# Altium schematic sheet mainboard.SchDoc
size C; SheetNumber: 1; SheetTotal: 1
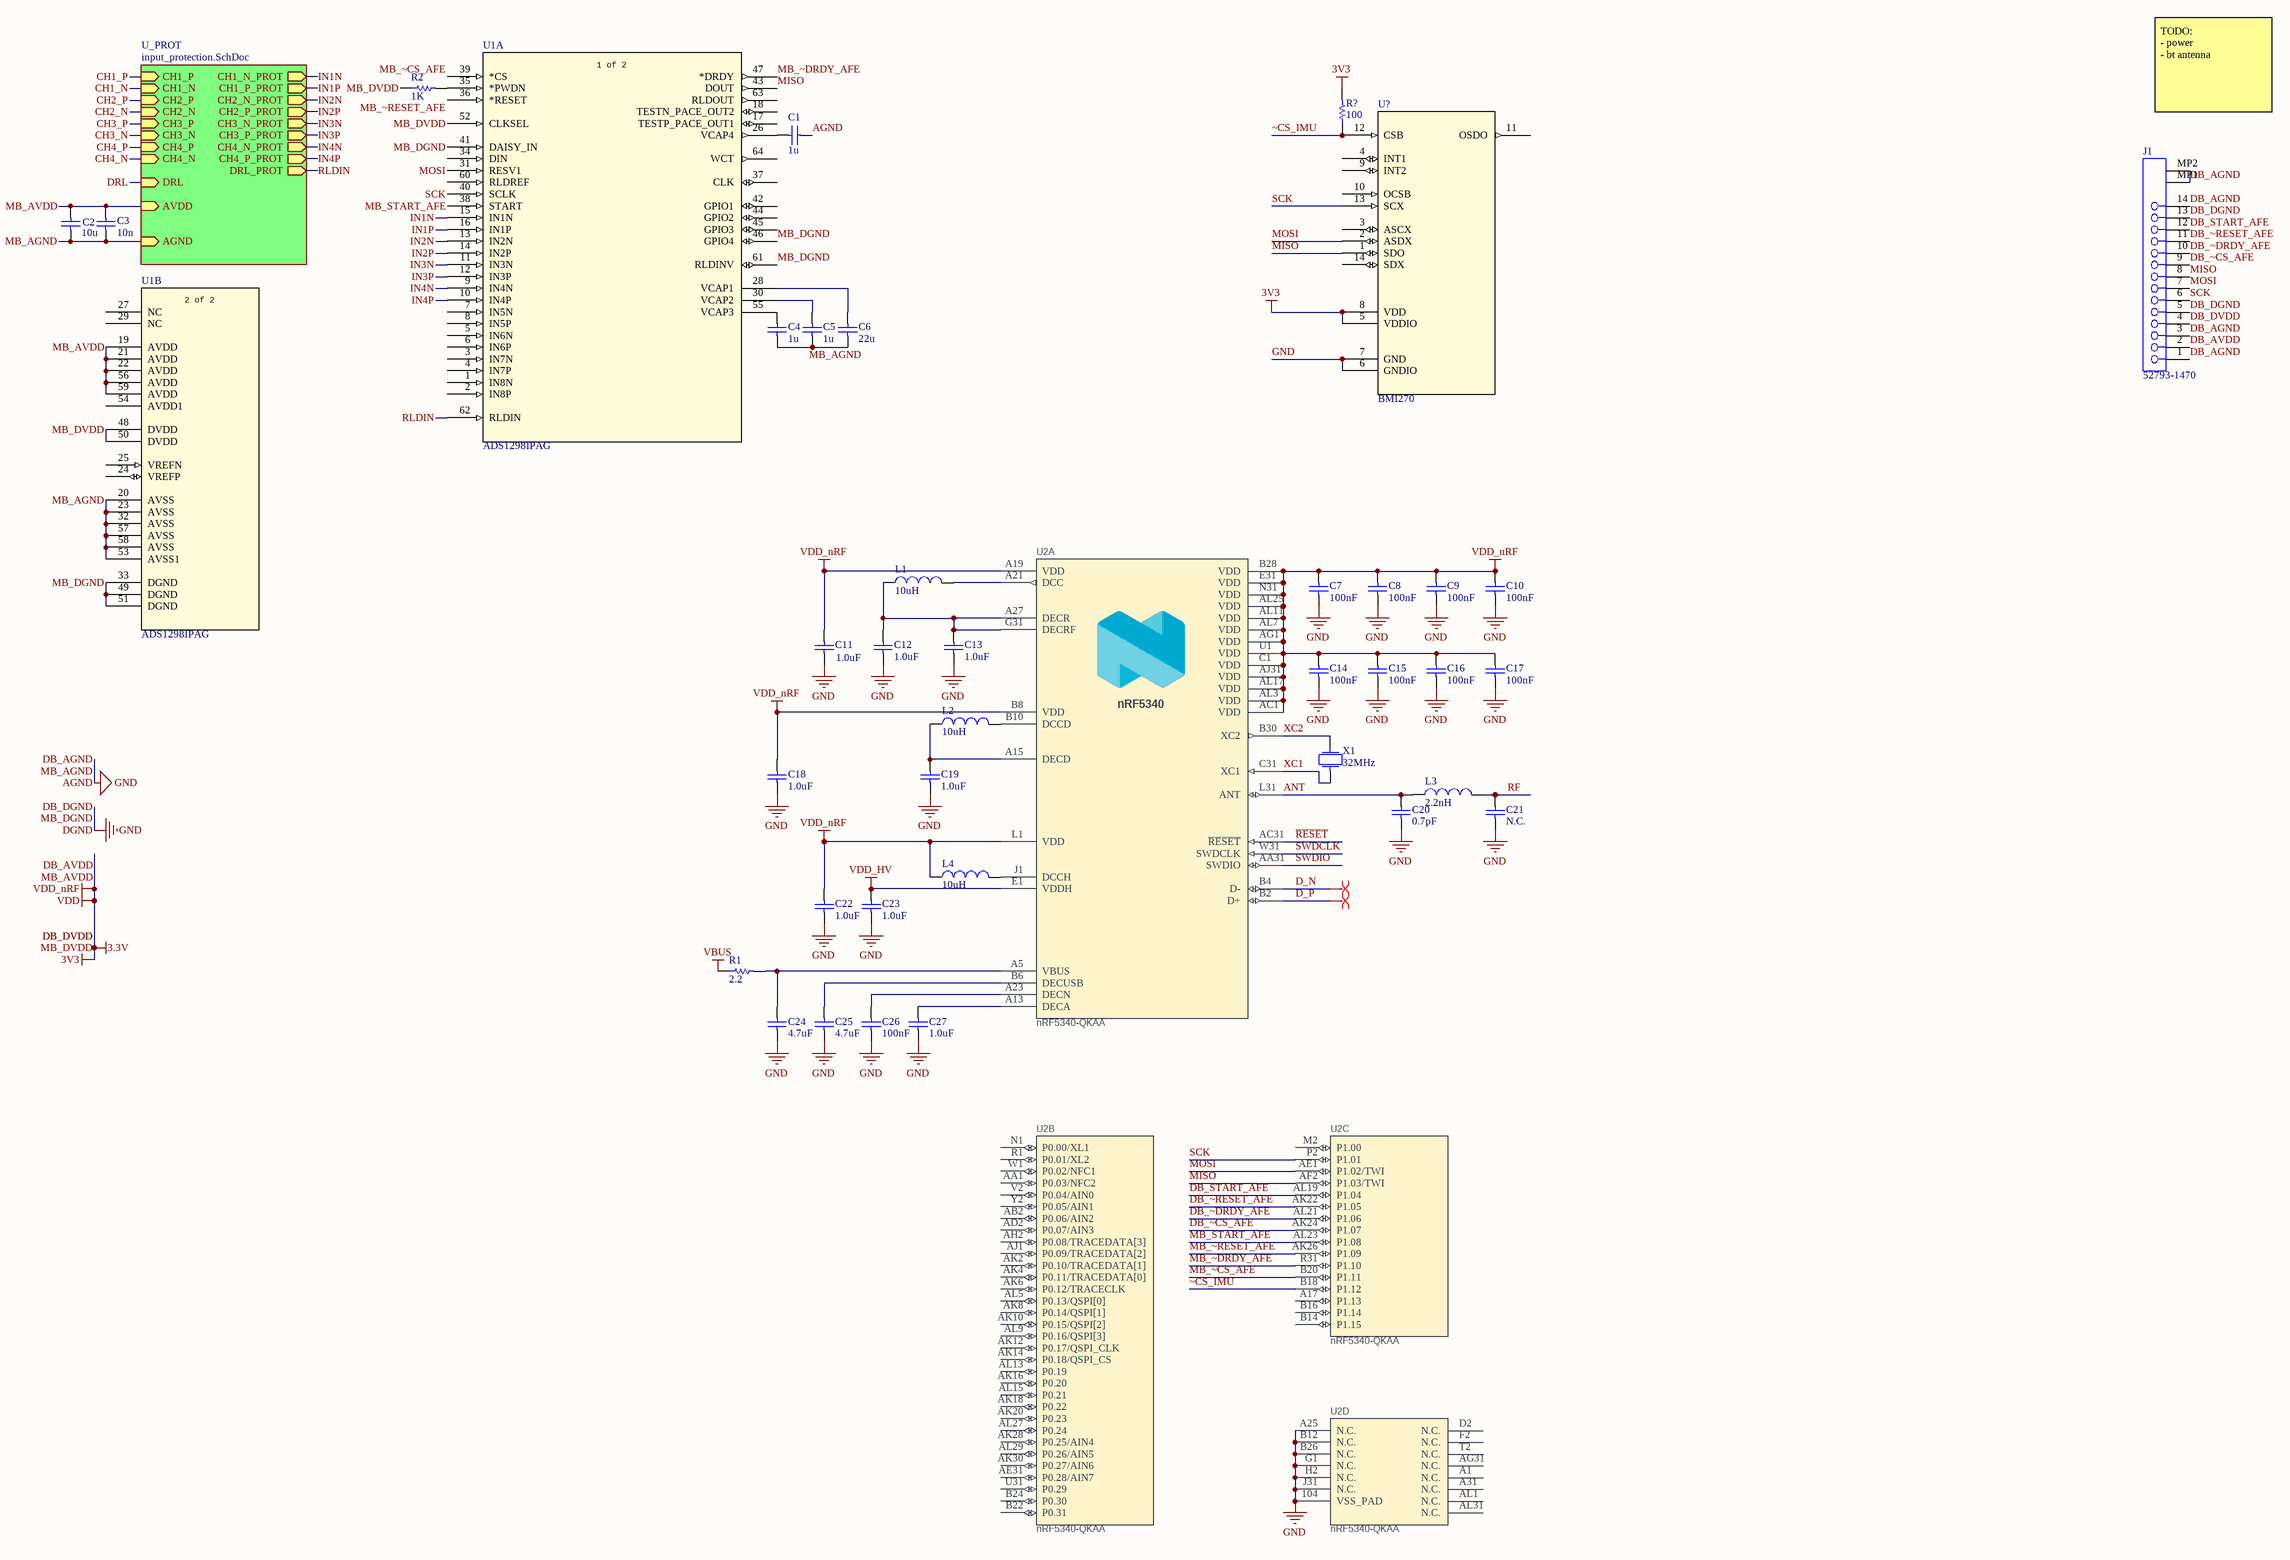
[diagram p0: mainboard.SchDoc]

## Parts
C1  value 1u  (hidden comment: Capacitor)
C2  value 10u  (hidden comment: Capacitor)
C3  value 10n  (hidden comment: Capacitor)
C4  value 1u  (hidden comment: Capacitor)
C5  value 1u  (hidden comment: Capacitor)
C6  value 22u  (hidden comment: Capacitor)
C7  value 100nF  (hidden comment: Capacitor)
C8  value 100nF  (hidden comment: Capacitor)
C9  value 100nF  (hidden comment: Capacitor)
C10  value 100nF  (hidden comment: Capacitor)
C11  value 1.0uF  (hidden comment: Capacitor)
C12  value 1.0uF  (hidden comment: Capacitor)
C13  value 1.0uF  (hidden comment: Capacitor)
C14  value 100nF  (hidden comment: Capacitor)
C15  value 100nF  (hidden comment: Capacitor)
C16  value 100nF  (hidden comment: Capacitor)
C17  value 100nF  (hidden comment: Capacitor)
C18  value 1.0uF  (hidden comment: Capacitor)
C19  value 1.0uF  (hidden comment: Capacitor)
C20  value 0.7pF  (hidden comment: Capacitor)
C21  value N.C.  (hidden comment: Capacitor)
C22  value 1.0uF  (hidden comment: Capacitor)
C23  value 1.0uF  (hidden comment: Capacitor)
C24  value 4.7uF  (hidden comment: Capacitor)
C25  value 4.7uF  (hidden comment: Capacitor)
C26  value 100nF  (hidden comment: Capacitor)
C27  value 1.0uF  (hidden comment: Capacitor)
J1  52793-1470  [MOLX-52793-1470]
L1  value 10uH  (hidden comment: Inductor)
L2  value 10uH  (hidden comment: Inductor)
L3  value 2.2nH  (hidden comment: Inductor)
L4  value 10uH  (hidden comment: Inductor)
R1  value 2.2  (hidden comment: Resistor)
R2  value 1K  (hidden comment: Resistor)
R?  value 100  (hidden comment: Resistor)
U1  ADS1298IPAG  [PAG64]  (parts A,B of 2)
U2  nRF5340-QKAA  [AQFN40P700X700X85_HS-99N]  (parts A,B,C,D of 4)
U?  BMI270  [BMI270_BOS]
X1  F0: 32MHz  (hidden comment: Crystal)

## Sub-sheets
U_PROT = input_protection.SchDoc: CH1_P (in), CH1_N_PROT (out), CH1_P_PROT (out), CH1_N (in), CH2_P (in), CH2_N (in), CH3_P (in), CH3_N (in), CH4_P (in), CH4_N (in), DRL (in), AVDD (in), AGND (in), CH2_N_PROT (out), CH2_P_PROT (out), CH3_N_PROT (out), CH3_P_PROT (out), CH4_N_PROT (out), CH4_P_PROT (out), DRL_PROT (out)

## Nets
AGND: C1.2 C2.2 C3.2 C4.2 C5.2 C6.2 C7.1 C8.1 C9.1 C10.1 C11.1 C12.1 C13.1 C14.1 C15.1 C16.1 C17.1 C18.1 C19.1 C20.1 C21.1 C22.1 C23.1 C24.1 C25.1 C26.1 C27.1 J1.1 J1.3 J1.5 J1.13 J1.14 J1.MP1 J1.MP2 U1.20(AVSS) U1.23(AVSS) U1.32(AVSS) U1.33(DGND) U1.41(DAISY_IN) U1.46(GPIO4) U1.49(DGND) U1.51(DGND) U1.53(AVSS1) U1.57(AVSS) U1.58(AVSS) U1.61(RLDINV) U2.104(VSS_PAD) U2.A25(N.C.) U2.B12(N.C.) U2.B26(N.C.) U2.G1(N.C.) U2.H2(N.C.) U2.J31(N.C.) U?.6(GNDIO) U?.7(GND) ; sheet U_PROT/AGND  [also labelled DB_AGND, DB_DGND, DGND, GND, MB_AGND, MB_DGND]
DB_AVDD: C2.1 C3.1 C7.2 C8.2 C9.2 C10.2 C11.2 C14.2 C15.2 C16.2 C17.2 C18.2 C22.2 J1.2 J1.4 L4.1 R2.1 R?.2 U1.19(AVDD) U1.21(AVDD) U1.22(AVDD) U1.48(DVDD) U1.50(DVDD) U1.52(CLKSEL) U1.56(AVDD) U1.59(AVDD) U2.A19(VDD) U2.AC1(VDD) U2.AG1(VDD) U2.AJ31(VDD) U2.AL3(VDD) U2.AL7(VDD) U2.AL11(VDD) U2.AL17(VDD) U2.AL25(VDD) U2.B8(VDD) U2.B28(VDD) U2.C1(VDD) U2.E31(VDD) U2.L1(VDD) U2.N31(VDD) U2.U1(VDD) U?.5(VDDIO) U?.8(VDD) ; sheet U_PROT/AVDD  [also labelled 3.3V, 3V3, DB_DVDD, MB_AVDD, MB_DVDD, VDD, VDD_nRF]
VBUS: R1.1
VDD_HV: C23.2 U2.E1(VDDH)
ANT: C20.2 L3.1 U2.L31(ANT)
CH1_N: sheet U_PROT/CH1_N
CH1_P: sheet U_PROT/CH1_P
CH2_N: sheet U_PROT/CH2_N
CH2_P: sheet U_PROT/CH2_P
CH3_N: sheet U_PROT/CH3_N
CH3_P: sheet U_PROT/CH3_P
CH4_N: sheet U_PROT/CH4_N
CH4_P: sheet U_PROT/CH4_P
D_N: U2.B4(D-)
D_P: U2.B2(D+)
DB_START_AFE: J1.12 U2.AL19(P1.04)
DB_~CS_AFE: J1.9 U2.AK24(P1.07)
DB_~DRDY_AFE: J1.10 U2.AL21(P1.06)
DB_~RESET_AFE: J1.11 U2.AK22(P1.05)
DRL: sheet U_PROT/DRL
IN1N: U1.15(IN1N) ; sheet U_PROT/CH1_N_PROT
IN1P: U1.16(IN1P) ; sheet U_PROT/CH1_P_PROT
IN2N: U1.13(IN2N) ; sheet U_PROT/CH2_N_PROT
IN2P: U1.14(IN2P) ; sheet U_PROT/CH2_P_PROT
IN3N: U1.11(IN3N) ; sheet U_PROT/CH3_N_PROT
IN3P: U1.12(IN3P) ; sheet U_PROT/CH3_P_PROT
IN4N: U1.9(IN4N) ; sheet U_PROT/CH4_N_PROT
IN4P: U1.10(IN4P) ; sheet U_PROT/CH4_P_PROT
MB_START_AFE: U1.38(START) U2.AL23(P1.08)
MB_~CS_AFE: U1.39(*CS) U2.B20(P1.11)
MB_~DRDY_AFE: U1.47(*DRDY) U2.R31(P1.10)
MB_~RESET_AFE: U1.36(*RESET) U2.AK26(P1.09)
MISO: J1.8 U1.43(DOUT) U2.AF2(P1.03/TWI) U?.1(SDO)
MOSI: J1.7 U1.31(RESV1) U2.AE1(P1.02/TWI) U?.2(ASDX)
~{RESET}: U2.AC31(~{RESET})
RF: C21.2 L3.2
RLDIN: U1.62(RLDIN) ; sheet U_PROT/DRL_PROT
SCK: J1.6 U1.40(SCLK) U2.P2(P1.01) U?.13(SCX)
SWDCLK: U2.W31(SWDCLK)
SWDIO: U2.AA31(SWDIO)
XC1: U2.C31(XC1) X1.1
XC2: U2.B30(XC2) X1.2
~CS_IMU: R?.1 U2.B18(P1.12) U?.12(CSB)
NetC1_1: C1.1 U1.26(VCAP4)
NetC4_1: C4.1 U1.55(VCAP3)
NetC5_1: C5.1 U1.30(VCAP2)
NetC6_1: C6.1 U1.28(VCAP1)
NetC12_2: C12.2 C13.2 L1.1 U2.A27(DECR) U2.G31(DECRF)
NetC19_2: C19.2 L2.1 U2.A15(DECD)
NetC24_2: C24.2 R1.2 U2.A5(VBUS)
NetC25_2: C25.2 U2.B6(DECUSB)
NetC26_2: C26.2 U2.A23(DECN)
NetC27_2: C27.2 U2.A13(DECA)
NetL1_2: L1.2 U2.A21(DCC)
NetL2_2: L2.2 U2.B10(DCCD)
NetL4_2: L4.2 U2.J1(DCCH)
NetR2_2: R2.2 U1.35(*PWDN)

Not connected (* = marked no-connect by the designer): U1 1(IN8N) 2(IN8P) 3(IN7N) 4(IN7P) 5(IN6N) 6(IN6P) 7(IN5N) 8(IN5P) 17(TESTP_PACE_OUT1) 18(TESTN_PACE_OUT2) 24(VREFP) 25(VREFN) 27(NC) 29(NC) 34(DIN) 37(CLK) 42(GPIO1) 44(GPIO2) 45(GPIO3) 54(AVDD1) 60(RLDREF) 63(RLDOUT) 64(WCT); U2 A1(N.C.) A17(P1.13) A31(N.C.) AA1(P0.03/NFC2) AB2(P0.06/AIN2) AD2(P0.07/AIN3) AE31(P0.28/AIN7) AG31(N.C.) AH2(P0.08/TRACEDATA[3]) AJ1(P0.09/TRACEDATA[2]) AK2(P0.10/TRACEDATA[1]) AK4(P0.11/TRACEDATA[0]) AK6(P0.12/TRACECLK) AK8(P0.14/QSPI[1]) AK10(P0.15/QSPI[2]) AK12(P0.17/QSPI_CLK) AK14(P0.18/QSPI_CS) AK16(P0.20) AK18(P0.22) AK20(P0.23) AK28(P0.25/AIN4) AK30(P0.27/AIN6) AL1(N.C.) AL5(P0.13/QSPI[0]) AL9(P0.16/QSPI[3]) AL13(P0.19) AL15(P0.21) AL27(P0.24) AL29(P0.26/AIN5) AL31(N.C.) B14(P1.15) B16(P1.14) B22(P0.31) B24(P0.30) D2(N.C.) F2(N.C.) M2(P1.00) N1(P0.00/XL1) R1(P0.01/XL2) T2(N.C.) U31(P0.29) V2(P0.04/AIN0) W1(P0.02/NFC1) Y2(P0.05/AIN1); U? 3(ASCX) 4(INT1) 9(INT2) 10(OCSB) 11(OSDO) 14(SDX)

## Layout directives
differential pair: D_N, D_P

## Notes on the sheet
- TODO:
  - power
  - bt antenna
- (in symbol ADS1298IPAG, part A) 1 of 2
- (in symbol ADS1298IPAG, part B) 2 of 2
- (in symbol nRF5340-QKAA, part A) nRF5340

## Library data of the parts
C1-C27 = Capacitor: SimulationGenericComponent: True
J1 = CMP-1241-00393-1: 1.0 mm Pitch Easy-On(TM) Type FFC Connector, 3.1 mm Mated Height, Right Angle, Non-ZIF, SMT, Top Contact, 14 Circuits, -20 to 85 degC, ELV and RoHS Compliant, Tape and Reel; Manufacturer: Molex; Pitch - Mating Interface: 1.00mm; PCB Retention: Yes; Polarized to PCB: No; Mated Height: 3.10mm; Voltage (Max): 50V; Material - Metal: Phosphor Bronze; Entry Angle: 90degrees Angle; Current (Max per Contact): 0.5A; Durability (mating cycles max): 10; Material - Plating Termination: Tin-Bismuth; Circuits (Loaded): 14; ComponentLink3URL: http://www.molex.com/pdm_docs/sd/527931470_sd.pdf; Contact Position: Top; Orientation: Right Angle; ComponentLink2Description: Datasheet; PackageReference: 52793-1470; Mounting Technology: Surface Mount; PCB Locator: No; ComponentLink2URL: http://www.molex.com/webdocs/datasheets/pdf/en-us/0527931470_FFC_FPC_CONNECTORS.pdf; ComponentLink3Description: Package Specification; RoHS: TRUE; Packing: Tape and Reel; PackageDescription: 14-Lead FFC Connector, Pitch 1.0 mm; Pitch - Termination Interface: 1.00mm; PackageVersion: Rev. 0, 12/2003; ComponentLink1Description: Manufacturer URL; Material - Plating Mating: Tin-Bismuth; Stackable: No; Number of Rows: 1; PartNumber: 52793-1470; ComponentLink1URL: http://www.molex.com/molex/index.jsp
L1-L4 = Inductor: SimulationGenericComponent: True
R1 R2 R? = Resistor: TC1: 0; SimulationGenericComponent: True; TC2: 0
U1 = ADS1298IPAG: 8-Channel 24-bit ADC With Integrated ECG Front End 64-TQFP -40 to 85; Manufacturer_Name: Texas Instruments; Copyright: Copyright (C) 2026 Ultra Librarian. All rights reserved.; Manufacturer_Part_Number: ADS1298IPAG; RefDes: RefDes; Type: Type
U2 = nRF5340-QKAA: Multi-protocol Bluetooth Low Energy, IEEE 802.15.4, ANT and 2.4GHz proprietary system-on-chip; Pad Count: 98; Footprint Doc: AQFN-98; Value: nRF5340-QKAA; Component Class: nRF_Devices
U? = BMI270: Description; Manufacturer_Name: Bosch Sensortec; Copyright: Copyright (C) 2025 Ultra Librarian. All rights reserved.; Manufacturer_Part_Number: BMI270; RefDes: RefDes; Type: Type
X1 = Crystal: R: 500; Q: 50K; SimulationGenericComponent: True